# Altium schematic sheet CC0805FRNPO9BN8201_CC0805FRNPO9BN820.schdoc
size 127 x 101 mm
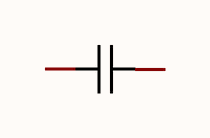
[diagram p0: CC0805FRNPO9BN8201_CC0805FRNPO9BN820.schdoc]

## Parts
C?  82pF  [C0805]  (value not drawn)

## Nets

Not connected (* = marked no-connect by the designer): C? 1 2

## Library data of the parts
C? = CC0805FRNPO9BN820: Manufacturer: YAGEO(国巨); Add into BOM: yes; Tolerance: ±1%; Voltage Rated: 50V; Temperature Coefficient: NP0; Symbol: CC0805FRNPO9BN820; Device: CC0805FRNPO9BN820; LCSC Part Name: 82pF ±1% 50V; Supplier Part: C527189; Manufacturer Part: CC0805FRNPO9BN820; Supplier Footprint: 0805; JLCPCB Part Class: Extended Part; Datasheet: https://atta.szlcsc.com/upload/public/pdf/source/20200508/C527189_AF3BD45761C292EB11165A31B5122D16.pdf; Supplier: LCSC; Convert to PCB: yes; Value: 82pF